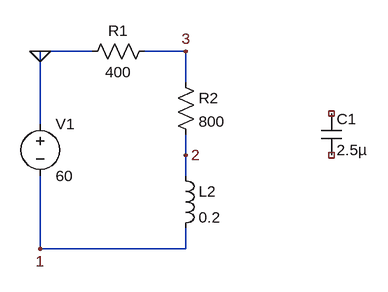
[diagram p0: schematic Draft1.asc]
Draft1.asc, the LTspice schematic file:
Version 4
SHEET 1 880 680
WIRE 0 128 -80 128
WIRE 144 128 80 128
WIRE 144 176 144 128
WIRE -80 240 -80 128
WIRE 144 288 144 256
WIRE 144 320 144 288
WIRE -80 432 -80 320
WIRE 144 432 144 400
WIRE 144 432 -80 432
FLAG -80 128 0
FLAG -80 432 1
FLAG 144 288 2
FLAG 144 128 3
SYMBOL res 96 112 R90
WINDOW 0 0 56 VBottom 2
WINDOW 3 32 56 VTop 2
SYMATTR InstName R1
SYMATTR Value 400
SYMBOL res 128 160 R0
SYMATTR InstName R2
SYMATTR Value 800
SYMBOL ind 128 304 R0
SYMATTR InstName L2
SYMATTR Value 0.2
SYMBOL voltage -80 224 R0
WINDOW 123 0 0 Left 0
WINDOW 39 0 0 Left 0
SYMATTR InstName V1
SYMATTR Value 60
SYMBOL cap 352 224 R0
SYMATTR InstName C1
SYMATTR Value 2.5µ

The netlist it stands for:
* Draft1.asc
R1 3 0 400
R2 3 2 800
L2 2 1 0.2
V1 0 1 60
C1 NC_01 NC_02 2.5µ
.backanno
.end